# Altium schematic sheet main.SchDoc
size A4
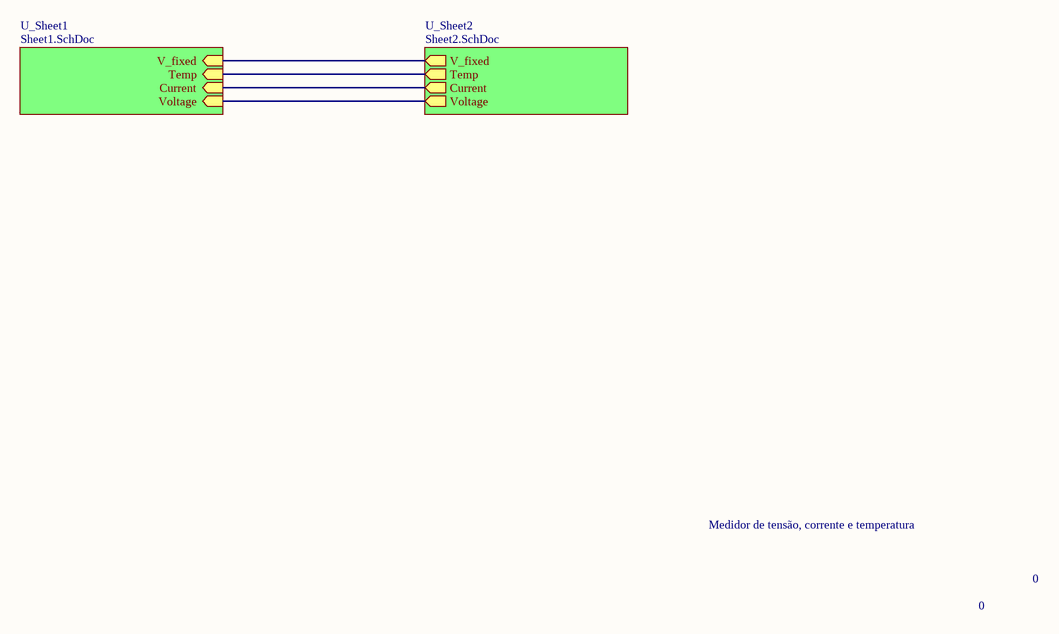
[diagram p0: main.SchDoc]

## Sub-sheets
U_Sheet1 = Sheet1.SchDoc: V_fixed (in), Temp (in), Current (in), Voltage (in)
U_Sheet2 = Sheet2.SchDoc: V_fixed (out), Temp (out), Current (out), Voltage (out)

## Nets
(unnamed): sheet U_Sheet1/V_fixed, sheet U_Sheet2/V_fixed
(unnamed): sheet U_Sheet1/Temp, sheet U_Sheet2/Temp
(unnamed): sheet U_Sheet1/Current, sheet U_Sheet2/Current
(unnamed): sheet U_Sheet1/Voltage, sheet U_Sheet2/Voltage

## Notes on the sheet
- Medidor de tensão, corrente e temperatura
- 0